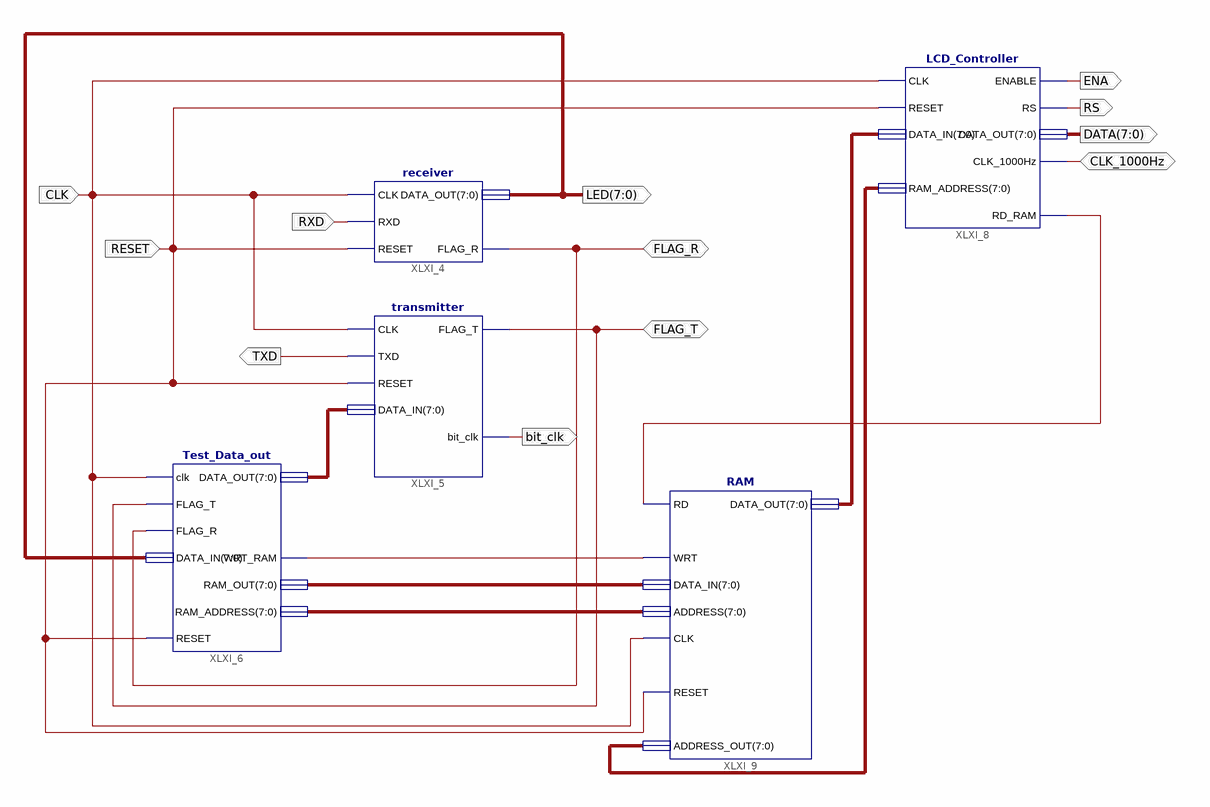
[diagram p0: schematic sheet 1]
// Xilinx ISE schematic TestSchem.sch (spartan3e) as structural Verilog: 5 symbols, 12 ports
module TestSchem (
  input  RXD,
  input  RESET,
  input  CLK,
  inout  FLAG_R,
  inout  FLAG_T,
  inout  CLK_1000Hz,
  output bit_clk,
  output TXD,
  output [7:0] LED,
  output ENA,
  output RS,
  output [7:0] DATA
);

  wire XLXN_18, XLXN_65;
  wire [7:0] XLXN_4, XLXN_19, XLXN_20, XLXN_38, XLXN_64;

  receiver XLXI_4 (.CLK(CLK), .RXD(RXD), .RESET(RESET), .FLAG_R(FLAG_R), .DATA_OUT(LED));
  transmitter XLXI_5 (.CLK(CLK), .RESET(RESET), .DATA_IN(XLXN_4), .FLAG_T(FLAG_T), .TXD(TXD), .bit_clk(bit_clk));
  Test_Data_out XLXI_6 (
    .FLAG_T(FLAG_T), .FLAG_R(FLAG_R), .RESET(RESET), .clk(CLK), .DATA_IN(LED), .WRT_RAM(XLXN_18),
    .DATA_OUT(XLXN_4), .RAM_OUT(XLXN_20), .RAM_ADDRESS(XLXN_19));
  RAM XLXI_9 (
    .RD(XLXN_65), .CLK(CLK), .RESET(RESET), .WRT(XLXN_18), .DATA_IN(XLXN_20), .ADDRESS(XLXN_19),
    .ADDRESS_OUT(XLXN_64), .DATA_OUT(XLXN_38));
  LCD_Controller XLXI_8 (
    .CLK(CLK), .RESET(RESET), .DATA_IN(XLXN_38), .CLK_1000Hz(CLK_1000Hz), .ENABLE(ENA), .RD_RAM(XLXN_65),
    .RS(RS), .DATA_OUT(DATA), .RAM_ADDRESS(XLXN_64));
endmodule
